# EAGLE design GPR (EAGLE 9.6.2)
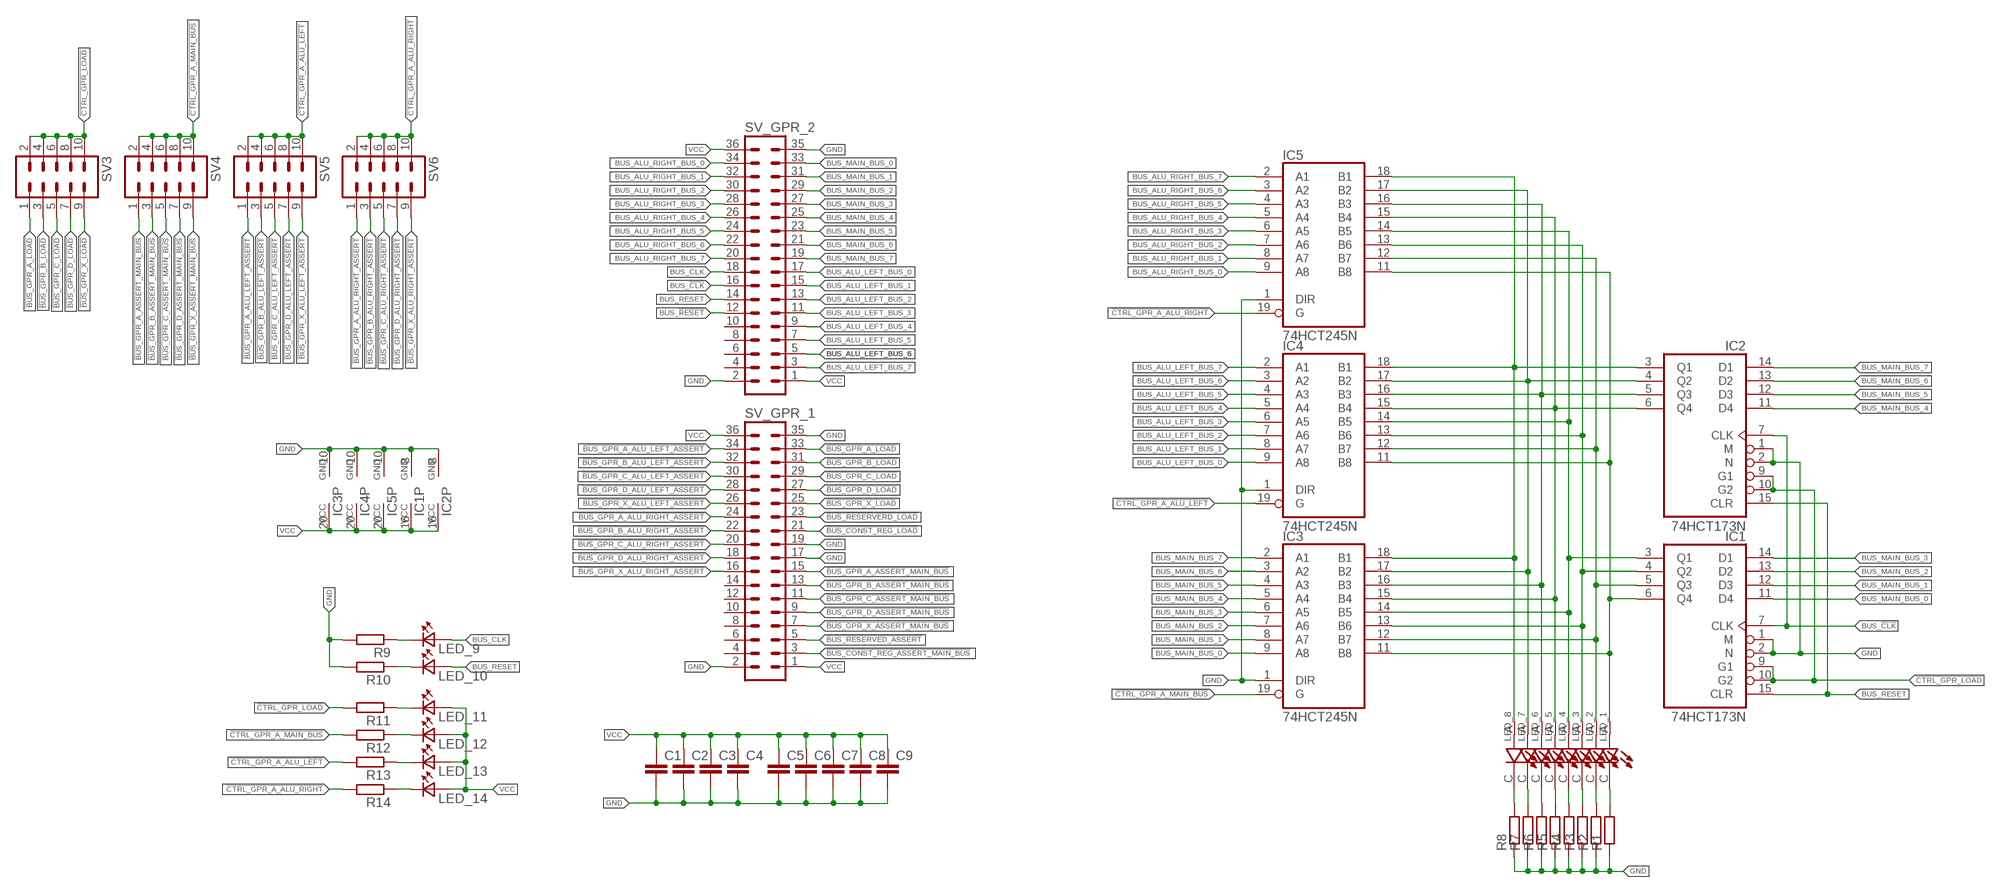
[diagram p0: schematic, sheet 1]

## Parts
C1  C-EUC0805  [C0805]
C2  C-EUC0805  [C0805]
C3  C-EUC0805  [C0805]
C4  C-EUC0805  [C0805]
C5  C-EUC0805  [C0805]
C6  C-EUC0805  [C0805]
C7  C-EUC0805  [C0805]
C8  C-EUC0805  [C0805]
C9  C-EUC0805  [C0805]
IC1  74HCT173N  [DIL16]
IC2  74HCT173N  [DIL16]
IC3  74HCT245N  [DIL20]
IC4  74HCT245N  [DIL20]
IC5  74HCT245N  [DIL20]
LED_1  LTST-C193KRKT-5A  [LEDC1608X45N]
LED_2  LTST-C193KRKT-5A  [LEDC1608X45N]
LED_3  LTST-C193KRKT-5A  [LEDC1608X45N]
LED_4  LTST-C193KRKT-5A  [LEDC1608X45N]
LED_5  LTST-C193KRKT-5A  [LEDC1608X45N]
LED_6  LTST-C193KRKT-5A  [LEDC1608X45N]
LED_7  LTST-C193KRKT-5A  [LEDC1608X45N]
LED_8  LTST-C193KRKT-5A  [LEDC1608X45N]
LED_9  LTST-C193TBKT-5A  [0603]
LED_10  LTST-C193TBKT-5A  [0603]
LED_11  LTST-C193TBKT-5A  [0603]
LED_12  LTST-C193TBKT-5A  [0603]
LED_13  LTST-C193TBKT-5A  [0603]
LED_14  LTST-C193TBKT-5A  [0603]
R1  R-EU_R0805  [R0805]
R2  R-EU_R0805  [R0805]
R3  R-EU_R0805  [R0805]
R4  R-EU_R0805  [R0805]
R5  R-EU_R0805  [R0805]
R6  R-EU_R0805  [R0805]
R7  R-EU_R0805  [R0805]
R8  R-EU_R0805  [R0805]
R9  R-EU_R0805  [R0805]
R10  R-EU_R0805  [R0805]
R11  R-EU_R0805  [R0805]
R12  R-EU_R0805  [R0805]
R13  R-EU_R0805  [R0805]
R14  R-EU_R0805  [R0805]
SV3  MA05-2  [MA05-2]
SV4  MA05-2  [MA05-2]
SV5  MA05-2  [MA05-2]
SV6  MA05-2  [MA05-2]
SV_GPR_1  MA18-2  [MA18-2]
SV_GPR_2  MA18-2  [MA18-2]

## Nets
!BUS_CONST_REG_ASSERT_MAIN_BUS: SV_GPR_1.3
!BUS_CONST_REG_LOAD: SV_GPR_1.21
!BUS_GPR_A_ALU_LEFT_ASSERT: SV5.1 SV_GPR_1.34
!BUS_GPR_A_ALU_RIGHT_ASSERT: SV6.1 SV_GPR_1.24
!BUS_GPR_A_ASSERT_MAIN_BUS: SV4.1 SV_GPR_1.15
!BUS_GPR_A_LOAD: SV3.1 SV_GPR_1.33
!BUS_GPR_B_ALU_LEFT_ASSERT: SV5.3 SV_GPR_1.32
!BUS_GPR_B_ALU_RIGHT_ASSERT: SV6.3 SV_GPR_1.22
!BUS_GPR_B_ASSERT_MAIN_BUS: SV4.3 SV_GPR_1.13
!BUS_GPR_B_LOAD: SV3.3 SV_GPR_1.31
!BUS_GPR_C_ALU_LEFT_ASSERT: SV5.5 SV_GPR_1.30
!BUS_GPR_C_ALU_RIGHT_ASSERT: SV6.5 SV_GPR_1.20
!BUS_GPR_C_ASSERT_MAIN_BUS: SV4.5 SV_GPR_1.11
!BUS_GPR_C_LOAD: SV3.5 SV_GPR_1.29
!BUS_GPR_D_ALU_LEFT_ASSERT: SV5.7 SV_GPR_1.28
!BUS_GPR_D_ALU_RIGHT_ASSERT: SV6.7 SV_GPR_1.18
!BUS_GPR_D_ASSERT_MAIN_BUS: SV4.7 SV_GPR_1.9
!BUS_GPR_D_LOAD: SV3.7 SV_GPR_1.27
!BUS_GPR_X_ALU_LEFT_ASSERT: SV5.9 SV_GPR_1.26
!BUS_GPR_X_ALU_RIGHT_ASSERT: SV6.9 SV_GPR_1.16
!BUS_GPR_X_ASSERT_MAIN_BUS: SV4.9 SV_GPR_1.7
!BUS_GPR_X_LOAD: SV3.9 SV_GPR_1.25
!BUS_RESERVED_ASSERT: SV_GPR_1.5
!BUS_RESERVERD_LOAD: SV_GPR_1.23
!CTRL_GPR_A_ALU_LEFT: IC4.19(G) R13.2 SV5.2 SV5.4 SV5.6 SV5.8 SV5.10
!CTRL_GPR_A_ALU_RIGHT: IC5.19(G) R14.2 SV6.2 SV6.4 SV6.6 SV6.8 SV6.10
!CTRL_GPR_A_MAIN_BUS: IC3.19(G) R12.2 SV4.2 SV4.4 SV4.6 SV4.8 SV4.10
!CTRL_GPR_LOAD: IC1.9(G1) IC1.10(G2) IC2.9(G1) IC2.10(G2) R11.2 SV3.2 SV3.4 SV3.6 SV3.8 SV3.10
BUS_!CLK: IC1.7(CLK) IC2.7(CLK) SV_GPR_2.16
BUS_!RESET: SV_GPR_2.12
BUS_ALU_LEFT_BUS_0: IC4.9(A8) SV_GPR_2.17
BUS_ALU_LEFT_BUS_1: IC4.8(A7) SV_GPR_2.15
BUS_ALU_LEFT_BUS_2: IC4.7(A6) SV_GPR_2.13
BUS_ALU_LEFT_BUS_3: IC4.6(A5) SV_GPR_2.11
BUS_ALU_LEFT_BUS_4: IC4.5(A4) SV_GPR_2.9
BUS_ALU_LEFT_BUS_5: IC4.4(A3) SV_GPR_2.7
BUS_ALU_LEFT_BUS_6: IC4.3(A2) SV_GPR_2.5
BUS_ALU_LEFT_BUS_7: IC4.2(A1) SV_GPR_2.3
BUS_ALU_RIGHT_BUS_0: IC5.9(A8) SV_GPR_2.34
BUS_ALU_RIGHT_BUS_1: IC5.8(A7) SV_GPR_2.32
BUS_ALU_RIGHT_BUS_2: IC5.7(A6) SV_GPR_2.30
BUS_ALU_RIGHT_BUS_3: IC5.6(A5) SV_GPR_2.28
BUS_ALU_RIGHT_BUS_4: IC5.5(A4) SV_GPR_2.26
BUS_ALU_RIGHT_BUS_5: IC5.4(A3) SV_GPR_2.24
BUS_ALU_RIGHT_BUS_6: IC5.3(A2) SV_GPR_2.22
BUS_ALU_RIGHT_BUS_7: IC5.2(A1) SV_GPR_2.20
BUS_CLK: LED_9.2(A2) SV_GPR_2.18
BUS_MAIN_BUS_0: IC1.11(D4) IC3.9(A8) SV_GPR_2.33
BUS_MAIN_BUS_1: IC1.12(D3) IC3.8(A7) SV_GPR_2.31
BUS_MAIN_BUS_2: IC1.13(D2) IC3.7(A6) SV_GPR_2.29
BUS_MAIN_BUS_3: IC1.14(D1) IC3.6(A5) SV_GPR_2.27
BUS_MAIN_BUS_4: IC2.11(D4) IC3.5(A4) SV_GPR_2.25
BUS_MAIN_BUS_5: IC2.12(D3) IC3.4(A3) SV_GPR_2.23
BUS_MAIN_BUS_6: IC2.13(D2) IC3.3(A2) SV_GPR_2.21
BUS_MAIN_BUS_7: IC2.14(D1) IC3.2(A1) SV_GPR_2.19
BUS_RESET: IC1.15(CLR) IC2.15(CLR) LED_10.2(A2) SV_GPR_2.14
GND: C1.2 C2.2 C3.2 C4.2 C5.2 C6.2 C7.2 C8.2 C9.2 IC1.1(M) IC1.2(N) IC1.8(GND) IC2.1(M) IC2.2(N) IC2.8(GND) IC3.1(DIR) IC3.10(GND) IC4.1(DIR) IC4.10(GND) IC5.1(DIR) IC5.10(GND) R1.1 R2.1 R3.1 R4.1 R5.1 R6.1 R7.1 R8.1 R9.2 R10.2 SV_GPR_1.2 SV_GPR_1.17 SV_GPR_1.19 SV_GPR_1.35 SV_GPR_2.2 SV_GPR_2.35
N$1: LED_9.1(K2) R9.1
N$2: LED_10.1(K2) R10.1
N$3: LED_11.1(K2) R11.1
N$4: LED_12.1(K2) R12.1
N$5: LED_13.1(K2) R13.1
N$6: LED_1.C R1.2
N$7: LED_2.C R2.2
N$8: LED_3.C R3.2
N$9: LED_4.C R4.2
N$10: LED_5.C R5.2
N$11: LED_6.C R6.2
N$12: LED_7.C R7.2
N$13: LED_8.C R8.2
N$14: LED_14.1(K2) R14.1
N$36: IC1.3(Q1) IC3.14(B5) IC4.14(B5) IC5.14(B5) LED_4.A
N$39: IC2.4(Q2) IC3.17(B2) IC4.17(B2) IC5.17(B2) LED_7.A
N$68: IC2.6(Q4) IC3.15(B4) IC4.15(B4) IC5.15(B4) LED_5.A
N$70: IC2.5(Q3) IC3.16(B3) IC4.16(B3) IC5.16(B3) LED_6.A
N$72: IC1.6(Q4) IC3.11(B8) IC4.11(B8) IC5.11(B8) LED_1.A
N$73: IC1.5(Q3) IC3.12(B7) IC4.12(B7) IC5.12(B7) LED_2.A
N$74: IC1.4(Q2) IC3.13(B6) IC4.13(B6) IC5.13(B6) LED_3.A
N$77: IC2.3(Q1) IC3.18(B1) IC4.18(B1) IC5.18(B1) LED_8.A
VCC: C1.1 C2.1 C3.1 C4.1 C5.1 C6.1 C7.1 C8.1 C9.1 IC1.16(VCC) IC2.16(VCC) IC3.20(VCC) IC4.20(VCC) IC5.20(VCC) LED_11.2(A2) LED_12.2(A2) LED_13.2(A2) LED_14.2(A2) SV_GPR_1.1 SV_GPR_1.36 SV_GPR_2.1 SV_GPR_2.36
Unconnected: SV_GPR_1.4 SV_GPR_1.6 SV_GPR_1.8 SV_GPR_1.10 SV_GPR_1.12 SV_GPR_1.14 SV_GPR_2.4 SV_GPR_2.6 SV_GPR_2.8 SV_GPR_2.10

## Library data of the parts
C1-C9 = rcl:C-EU: CAPACITOR, European symbol; SPICEPREFIX: C
IC1 IC2 = 74xx-eu:74*173: 4-bit D type REGISTER, 3-state
IC3-IC5 = 74xx-eu:74*245: Octal BUS TRANSCEIVER, 3-state
LED_1-LED_8 = Dargon's_lib:LTST-C193KRKT-5A: Red 631nm LED Indication - Discrete 2V 0603 (1608 Metric); MANUFACTURER: Lite-On; MAXIMUM_PACKAGE_HEIGHT: 0.45 mm; PARTREV: C; STANDARD: IPC 7351B
LED_9-LED_14 = Dargon's_lib:LTST-C193TBKT-5A: http://octopart.com/ltst-c190tbkt-lite-on-550003
R1-R14 = rcl:R-EU_: RESISTOR, European symbol; SPICEPREFIX: R
SV3-SV6 = con-lstb:MA05-2: PIN HEADER; OC_FARNELL: unknown; OC_NEWARK: unknown
SV_GPR_1 SV_GPR_2 = con-lstb:MA18-2: PIN HEADER; OC_FARNELL: unknown; OC_NEWARK: unknown

## Board
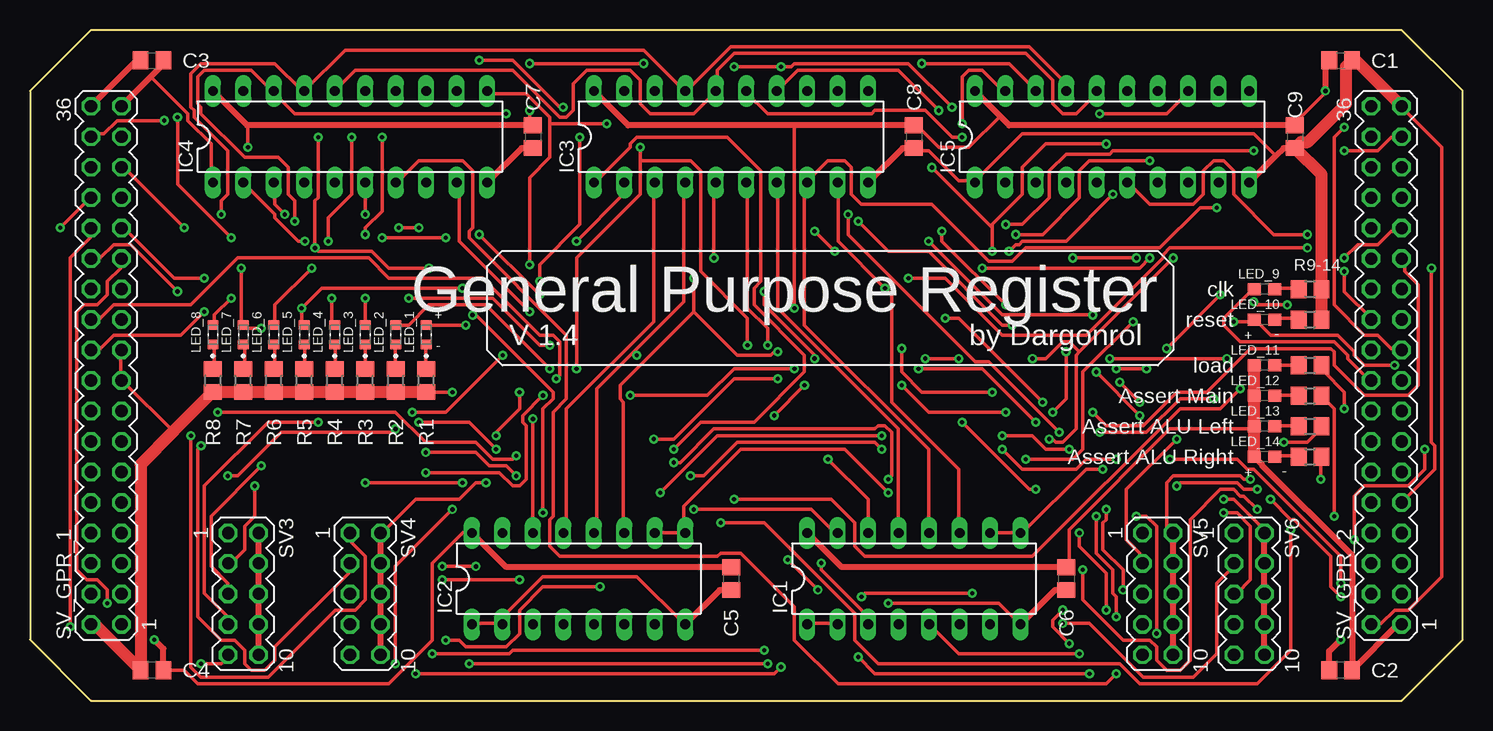
[diagram p1: board, top side]
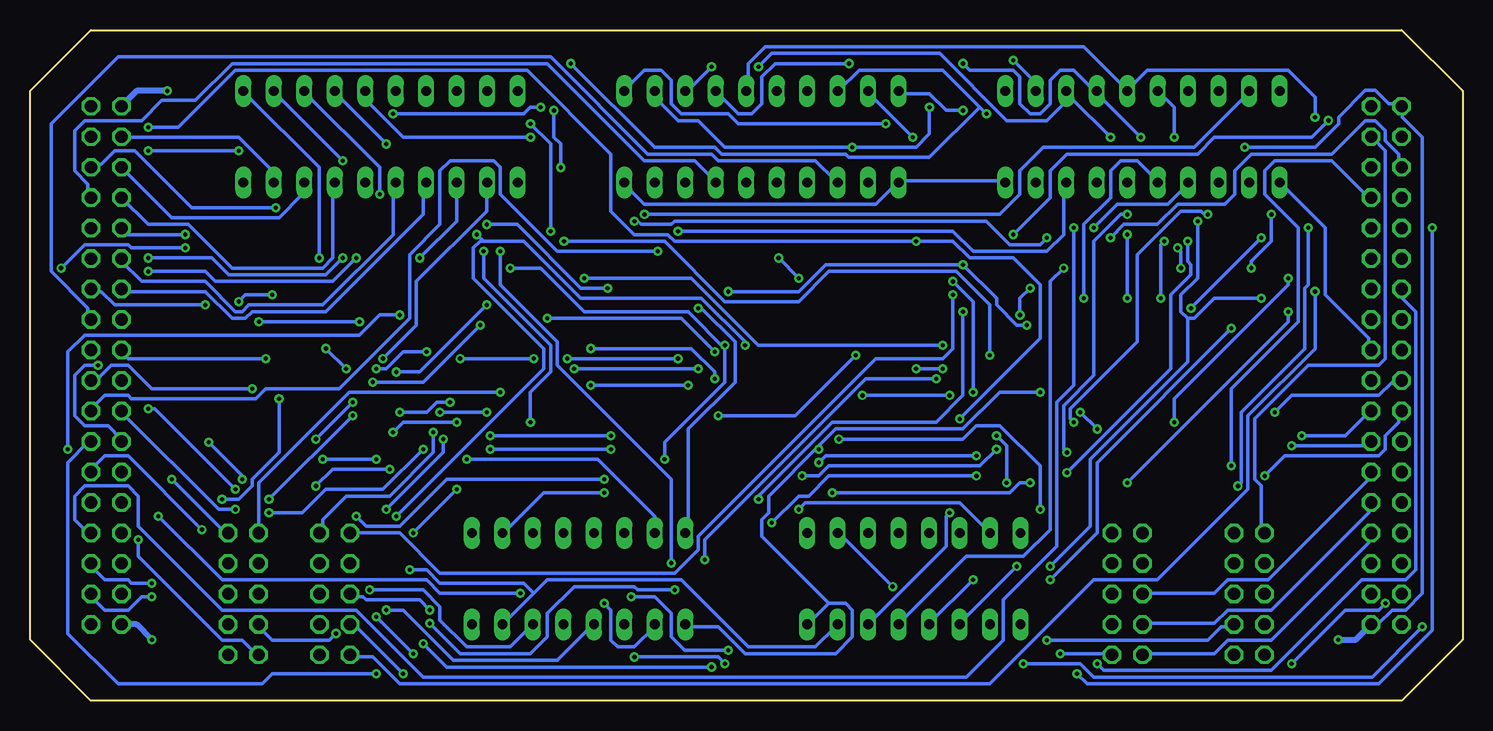
[diagram p2: board, bottom side, seen from below]

Size 119.38 x 55.88 mm. Coordinates in mm from the lower left corner, seen from the top.
Outline: 0,50.8 0,5.08 5.08,0 114.3,0 119.38,5.08 119.38,50.8 114.3,55.88 5.08,55.88 0,50.8
Copper layers (1*16): Top 0.035mm / dielectric 1.5mm / Bottom 0.035mm
Design rules "default *": minimum track width 12mil, minimum drill 0.35mm, track to track 10mil, track to pad 10mil, pad to pad 6mil, via to via 6mil, smd to smd 6mil, copper to edge 40mil, drill to drill 6mil, minimum pad ring 10mil, minimum via ring 8mil, stop-mask expansion 4mil, vias tented up to drill 0mil, thermal gap 10mil

### Footprints (pad centres in the part's own frame; a part is rotated, then mirrored left to right if it is on the bottom)
C0805 = smd 1.3 x 1.5: 1 -0.95,0; 2 0.95,0
DIL16 = drill 0.813 long: 1 -8.89,-3.81; 2 -6.35,-3.81; 3 -3.81,-3.81; 4 -1.27,-3.81; 5 1.27,-3.81; 6 3.81,-3.81; 7 6.35,-3.81; 8 8.89,-3.81; 9 8.89,3.81; 10 6.35,3.81; 11 3.81,3.81; 12 1.27,3.81; 13 -1.27,3.81; 14 -3.81,3.81; 15 -6.35,3.81; 16 -8.89,3.81
DIL20 = drill 0.813 long: 1 -11.43,-3.81; 2 -8.89,-3.81; 3 -6.35,-3.81; 4 -3.81,-3.81; 5 -1.27,-3.81; 6 1.27,-3.81; 7 3.81,-3.81; 8 6.35,-3.81; 9 8.89,-3.81; 10 11.43,-3.81; 11 11.43,3.81; 12 8.89,3.81; 13 6.35,3.81; 14 3.81,3.81; 15 1.27,3.81; 16 -1.27,3.81; 17 -3.81,3.81; 18 -6.35,3.81; 19 -8.89,3.81; 20 -11.43,3.81
LEDC1608X45N = smd 0.81 x 0.93: A 0.81,0; C -0.81,0
0603 = smd 1.1 x 1: 1 -0.85,0; 2 0.85,0
R0805 = smd 1.3 x 1.5: 1 -0.95,0; 2 0.95,0
MA05-2 = drill 1.016 octagon: 1 -5.08,-1.27; 2 -5.08,1.27; 3 -2.54,-1.27; 4 -2.54,1.27; 5 0,-1.27; 6 0,1.27; 7 2.54,-1.27; 8 2.54,1.27; 9 5.08,-1.27; 10 5.08,1.27
MA18-2 = drill 1.016 octagon: 1 -21.59,-1.27; 2 -21.59,1.27; 3 -19.05,-1.27; 4 -19.05,1.27; 5 -16.51,-1.27; 6 -16.51,1.27; 7 -13.97,-1.27; 8 -13.97,1.27; 9 -11.43,-1.27; 10 -11.43,1.27; 11 -8.89,-1.27; 12 -8.89,1.27; 13 -6.35,-1.27; 14 -6.35,1.27; 15 -3.81,-1.27; 16 -3.81,1.27; 17 -1.27,-1.27; 18 -1.27,1.27; 19 1.27,-1.27; 20 1.27,1.27; 21 3.81,-1.27; 22 3.81,1.27; 23 6.35,-1.27; 24 6.35,1.27; 25 8.89,-1.27; 26 8.89,1.27; 27 11.43,-1.27; 28 11.43,1.27; 29 13.97,-1.27; 30 13.97,1.27; 31 16.51,-1.27; 32 16.51,1.27; 33 19.05,-1.27; 34 19.05,1.27; 35 21.59,-1.27; 36 21.59,1.27

### Placement (x,y rotation side)
C1  109.22,53.34 0 top
C2  109.22,2.54 180 top
C3  10.16,53.34 0 top
C4  10.16,2.54 180 top
C5  58.42,10.16 270 top
C6  86.36,10.16 270 top
C7  41.91,46.99 270 top
C8  73.66,46.99 270 top
C9  105.41,46.99 270 top
IC1  73.66,10.16 0 top
IC2  45.72,10.16 0 top
IC3  58.42,46.99 0 top
IC4  26.67,46.99 0 top
IC5  90.17,46.99 0 top
LED_1  33.02,30.48 90 top
LED_2  30.48,30.48 90 top
LED_3  27.94,30.48 90 top
LED_4  25.4,30.48 90 top
LED_5  22.86,30.48 90 top
LED_6  20.32,30.48 90 top
LED_7  17.78,30.48 90 top
LED_8  15.24,30.48 90 top
LED_9  102.87,34.29 180 top
LED_10  102.87,31.75 180 top
LED_11  102.87,27.94 180 top
LED_12  102.87,25.4 180 top
LED_13  102.87,22.86 180 top
LED_14  102.87,20.32 180 top
R1  33.02,26.67 90 top
R2  30.48,26.67 90 top
R3  27.94,26.67 90 top
R4  25.4,26.67 90 top
R5  22.86,26.67 90 top
R6  20.32,26.67 90 top
R7  17.78,26.67 90 top
R8  15.24,26.67 90 top
R9  106.68,34.29 0 top
R10  106.68,31.75 0 top
R11  106.68,27.94 0 top
R12  106.68,25.4 0 top
R13  106.68,22.86 0 top
R14  106.68,20.32 0 top
SV3  17.78,8.89 270 top
SV4  27.94,8.89 270 top
SV5  93.98,8.89 270 top
SV6  101.6,8.89 270 top
SV_GPR_1  6.35,27.94 90 top
SV_GPR_2  113.03,27.94 90 top

### Tracks (layer width: path | path; a pad name or v marks a point on that pad's centre or on a via)
!BUS_GPR_A_ALU_LEFT_ASSERT  (via drill 0.35)
  Top 0.305: v11.18,48.34 7.26,48.34 6.15,47.22 5.31,47.22 SV_GPR_1.34 | v42.47,33.81 v37.44,38.84
  Bottom 0.305: v11.18,48.34 12.57,46.94 20.68,46.94 22.07,45.54 32.97,45.54 34.37,44.15 34.37,41.91 v37.44,38.84 | v42.47,33.81 42.47,29.34 43.31,28.5 48.9,28.5 63.7,13.69 63.7,12.57 65.66,10.62 85.22,10.62 88.57,13.97 SV5.1
!BUS_GPR_A_ALU_RIGHT_ASSERT  (via drill 0.35)
  Top 0.305: v30.45,3.07 30.45,11.18 v35.2,15.93 | v51.97,21.79 53.65,21.79 58.67,26.82 v62.31,26.82 | v72.64,29.34 72.64,27.38 74.32,25.7 v80.19,25.7
  Bottom 0.305: v30.45,3.07 29.9,2.52 15.93,2.52 8.38,10.06 4.75,10.06 3.91,10.9 3.91,32.41 5.03,33.53 5.03,34.09 SV_GPR_1.24 | v35.2,15.93 35.2,19.56 38.56,22.91 40.51,22.91 41.63,21.79 v51.97,21.79 | v62.31,26.82 62.31,27.38 64.26,29.34 v72.64,29.34 | v80.19,25.7 92.76,25.7 100.31,18.16 100.31,13.97 SV6.1
!BUS_GPR_A_ASSERT_MAIN_BUS  (via drill 0.35)
  Top 0.305: v13.41,22.07 13.41,2.79 14.25,1.96 19.84,1.96 25.43,7.54 27.1,7.54 27.94,8.38 27.94,12.01 26.82,13.13 26.82,13.97 SV4.1
  Bottom 0.305: v13.41,22.07 9.78,22.07 7.82,24.03 SV_GPR_1.15
!BUS_GPR_A_LOAD
  Bottom 0.305: SV3.1 16.76,13.97 16.76,17.88 17.32,18.44 17.32,23.47 12.85,27.94 6.99,27.94 6.43,28.5 6.43,45.82 7.54,46.94 SV_GPR_1.33
!BUS_GPR_B_ALU_LEFT_ASSERT  (via drill 0.35)
  Top 0.305: v95.56,21.79 91.36,17.6 91.36,13.41 92.48,12.29 92.48,11.46 SV5.3 | v90.81,26.54 v92.48,24.87 | v81.86,31.29 81.03,31.29 74.88,37.44 71.53,37.44 v69.01,39.95 | v29.34,38.56 v34.65,38.56
  Bottom 0.305: v92.48,24.87 v95.56,21.79 | v90.81,26.54 86.61,26.54 v81.86,31.29 | v69.01,39.95 68.73,39.95 68.45,39.67 65.94,39.67 65.66,39.95 39.67,39.95 37.72,38 35.2,38 v34.65,38.56 | v29.34,38.56 28.22,39.67 25.43,39.67 23.75,41.35 19.84,41.35 19,42.19 19,44.15 17.6,45.54 10.9,45.54 8.1,48.34 7.26,48.34 6.43,47.5 6.43,46.66 5.31,45.54 5.31,44.7 SV_GPR_1.32
!BUS_GPR_B_ALU_RIGHT_ASSERT  (via drill 0.35)
  Top 0.305: v43.87,26.82 44.15,27.1 44.15,29.9 43.59,30.45 42.47,30.45 37.72,35.2 29.9,35.2 28.22,36.88 17.32,36.88 13.41,32.97 6.99,32.97 5.87,31.85 5.31,31.85 SV_GPR_1.22 | v65.66,9.22 v63.14,11.73 | v86.06,6.43 88.29,6.43 92.76,1.96 96.95,1.96 98.91,3.91 98.91,9.78 100.31,11.18 SV6.3
  Bottom 0.305: v43.87,26.82 49.73,26.82 63.14,13.41 v63.14,11.73 | v65.66,9.22 68.73,9.22 69.01,9.5 74.04,9.5 76.28,7.26 76.28,5.31 77.67,3.91 83.54,3.91 v86.06,6.43
!BUS_GPR_B_ASSERT_MAIN_BUS  (via drill 0.35)
  Top 0.305: v14.25,21.23 13.97,20.95 13.97,6.99 15.93,5.03 17.04,5.03 17.88,4.19 17.88,3.07 18.44,2.52 19.56,2.52 20.4,3.35 20.4,4.47 26.54,10.62 26.54,11.18 SV4.3
  Bottom 0.305: v14.25,21.23 8.1,21.23 7.82,21.51 SV_GPR_1.13
!BUS_GPR_B_LOAD  (via drill 0.35)
  Top 0.305: v12.85,39.4 7.82,44.42 SV_GPR_1.31 | v18.72,17.88 18.72,15.37 17.88,14.53 17.88,12.57 16.76,11.46 SV3.3
  Bottom 0.305: v12.85,39.4 12.85,34.65 13.13,34.37 13.13,29.34 18.44,24.03 18.44,18.16 v18.72,17.88
!BUS_GPR_C_ALU_LEFT_ASSERT  (via drill 0.35)
  Top 0.305: v86.06,7.54 85.22,6.71 85.22,6.15 v86.61,4.75 | v62.59,2.79 62.03,2.23 v32.13,2.23 | v2.52,39.4 5.03,41.91 SV_GPR_1.30
  Bottom 0.305: v86.06,7.54 86.89,8.38 91.36,8.38 91.64,8.66 92.48,8.66 SV5.5 | v86.61,4.75 84.66,2.79 v62.59,2.79 | v32.13,2.23 31.29,1.4 6.99,1.4 2.52,5.87 v2.52,39.4
!BUS_GPR_C_ALU_RIGHT_ASSERT  (via drill 0.35)
  Top 0.305: v14.53,32.41 12.57,30.45 6.99,30.45 5.87,29.34 5.31,29.34 SV_GPR_1.20 | v36.04,18.16 v27.94,18.16 | v52.53,17.32 57.28,22.07 v70.97,22.07 | v81.03,22.07 83.54,22.07 84.66,20.95 v86.61,20.95 | v99.47,15.65 100.58,15.65 101.7,14.53 101.7,10.06 100.58,8.94 SV6.5
  Bottom 0.305: v14.53,32.41 14.53,31.57 v27.94,18.16 | v36.04,18.16 36.88,18.16 37.72,17.32 v52.53,17.32 | v81.03,22.07 v70.97,22.07 | v86.61,20.95 89.97,17.6 94.72,17.6 96.67,15.65 v99.47,15.65
!BUS_GPR_C_ASSERT_MAIN_BUS
  Bottom 0.305: SV4.5 26.54,8.94 20.68,8.94 19.56,10.06 16.2,10.06 7.82,18.44 7.82,19 SV_GPR_1.11
!BUS_GPR_C_LOAD  (via drill 0.35)
  Top 0.305: v19.28,19.56 15.09,15.37 15.09,11.18 16.48,9.78 16.48,8.94 SV3.5
  Bottom 0.305: v19.28,19.56 19.28,25.98 13.69,31.57 13.69,39.4 16.48,42.19 16.48,44.15 15.65,44.98 10.9,44.98 7.82,41.91 SV_GPR_1.29
!BUS_GPR_D_ALU_LEFT_ASSERT  (via drill 0.35)
  Top 0.305: v3.35,6.15 3.35,36.88 5.03,38.56 5.03,39.12 SV_GPR_1.28 | v61.47,3.07 v36.6,3.07 | v69.01,3.63 70.41,2.23 v88.29,2.23
  Bottom 0.305: v3.35,6.15 7.54,1.96 30.73,1.96 31.85,3.07 v36.6,3.07 | v61.47,3.07 62.03,3.63 v69.01,3.63 | v88.29,2.23 92.48,6.43 SV5.7
!BUS_GPR_D_ALU_RIGHT_ASSERT  (via drill 0.35)
  Top 0.305: v15.65,24.03 30.45,24.03 32.97,21.51 37.16,21.51 38.56,20.12 40.23,20.12 v40.51,20.4 | v53.65,19.84 54.2,19.84 57,22.63 70.41,22.63 70.69,22.91 71.25,22.91 71.81,22.35 71.81,18.72 v71.53,18.44 | v92.2,15.37 93.04,15.37 93.88,14.53 v93.88,5.59
  Bottom 0.305: v15.65,24.03 14.25,25.43 6.99,25.43 5.87,26.54 5.31,26.54 SV_GPR_1.18 | v40.51,20.4 53.09,20.4 v53.65,19.84 | v71.53,18.44 84.66,18.44 88.57,14.53 91.36,14.53 v92.2,15.37 | v93.88,5.59 94.44,5.03 99.19,5.03 100.31,6.15 SV6.7
!BUS_GPR_D_ASSERT_MAIN_BUS
  Bottom 0.305: SV4.7 26.54,6.43 20.68,6.43 19.56,7.54 15.93,7.54 7.82,15.65 7.82,16.48 SV_GPR_1.9
!BUS_GPR_D_LOAD  (via drill 0.35)
  Top 0.305: v24.03,23.19 19.84,23.19 14.53,17.88 14.53,8.94 16.48,6.99 16.48,6.43 SV3.7 | v14.53,35.2 12.01,35.2 7.82,39.4 SV_GPR_1.27
  Bottom 0.305: v24.03,23.19 24.03,25.15 14.53,34.65 v14.53,35.2
!BUS_GPR_X_ALU_LEFT_ASSERT  (via drill 0.35)
  Top 0.305: v12.29,34.09 8.38,38 6.99,38 5.87,36.88 5.31,36.88 SV_GPR_1.26
  Bottom 0.305: v12.29,34.09 12.29,29.34 17.88,23.75 17.88,17.6 25.43,10.06 30.73,10.06 39.4,1.4 88.57,1.4 90.81,3.63 92.48,3.63 SV5.9
!BUS_GPR_X_ALU_RIGHT_ASSERT  (via drill 0.35)
  Top 0.305: v16.48,18.72 17.32,18.72 20.95,22.35 30.18,22.35 v30.45,22.63 | v31.85,24.03 34.65,24.03 v39.4,28.78 | v74.88,38.28 81.03,32.13 v88.57,32.13 | v116.23,20.95 116.23,19.28 114.83,17.88 111.2,17.88 110.36,17.04 v110.36,13.41
  Bottom 0.305: v16.48,18.72 14.81,20.4 6.99,20.4 6.43,20.95 6.43,22.07 5.31,23.19 5.31,24.03 SV_GPR_1.16 | v31.85,24.03 v30.45,22.63 | v39.4,28.78 39.4,32.97 42.19,35.76 52.81,35.76 55.32,33.25 61.47,33.25 66.5,38.28 v74.88,38.28 | v88.57,32.13 90.25,32.13 91.92,30.45 114.83,30.45 116.23,29.06 v116.23,20.95 | v110.36,13.41 110.36,12.01 103.38,5.03 101.7,5.03 100.58,3.91 SV6.9
!BUS_GPR_X_ASSERT_MAIN_BUS
  Bottom 0.305: SV4.9 26.54,3.91 20.68,3.91 19.56,5.03 15.93,5.03 7.82,13.13 7.82,13.97 SV_GPR_1.7
!BUS_GPR_X_LOAD  (via drill 0.35)
  Top 0.305: v6.43,8.1 6.43,9.22 5.59,10.06 4.75,10.06 3.91,10.9 3.91,32.41 4.47,32.97 5.59,32.97 6.43,33.81 6.43,34.92 7.54,36.04 7.54,36.6 SV_GPR_1.25 | v14.25,3.07 15.93,3.07 16.48,3.63 SV3.9
  Bottom 0.305: v6.43,8.1 6.99,7.54 9.78,7.54 v14.25,3.07
!CTRL_GPR_A_ALU_LEFT  (via drill 0.35)
  Top 0.305: v104.5,21.51 106.45,21.51 107.57,22.63 R13.2 | v101.7,18.44 101.14,18.44 100.86,18.72 95.28,18.72 94.72,18.16 94.72,14.25 95,13.97 SV5.2 | v68.17,40.51 68.17,38.84 78.79,28.22 79.91,28.22 v85.78,22.35
  Top 0.508: SV5.10 SV5.8 SV5.6 SV5.4 SV5.2
  Bottom 0.305: v104.5,21.51 101.7,18.72 v101.7,18.44 | v68.17,40.51 38.56,40.51 36.88,42.19 36.88,44.15 34.92,46.1 22.35,46.1 17.88,50.57 IC4.19 | v85.78,22.35 85.78,20.68 89.41,17.04 93.04,17.04 95,15.09 95,13.97 SV5.2
!CTRL_GPR_A_ALU_RIGHT  (via drill 0.35)
  Top 0.305: v107.57,18.44 107.57,20.12 R14.2 | v77.67,48.06 77.67,51.97 78.23,52.53 79.35,52.53 81.03,50.85 IC5.19 | v76,39.12 76,38.28 v81.31,32.97 | v92.48,23.75 v88.85,27.38 | v99.47,16.76 100.31,16.76 103.1,13.97 SV6.2
  Top 0.508: SV6.10 SV6.8 SV6.6 SV6.4 SV6.2
  Bottom 0.305: v107.57,18.44 103.1,13.97 SV6.2 | v77.67,48.06 76,46.38 v76,39.12 | v81.31,32.97 86.89,27.38 v88.85,27.38 | v99.47,16.76 v92.48,23.75
!CTRL_GPR_A_MAIN_BUS  (via drill 0.35)
  Top 0.305: v108.69,15.37 108.69,24.31 107.85,25.15 R12.2 | v78.51,8.94 69.57,8.94 v69.29,8.66 | v61.19,4.19 40.23,4.19 39.95,3.91 v33.53,3.91 | v45.82,46.94 45.82,39.67 42.47,36.32 v42.47,34.92 | v40.79,25.7 40.79,24.31 38.84,22.35 v38.84,22.07 | v38,18.16 37.16,18.16 35.76,16.76 32.13,16.76 29.34,13.97 SV4.2
  Top 0.508: SV4.10 SV4.8 SV4.6 SV4.4 SV4.2
  Bottom 0.305: v108.69,15.37 103.38,10.06 86.33,10.06 85.22,8.94 v78.51,8.94 | v69.29,8.66 67.33,8.66 65.94,7.26 65.94,5.31 64.82,4.19 v61.19,4.19 | v33.53,3.91 29.34,3.91 SV4.10 | v45.82,46.94 49.45,50.57 IC3.19 | v42.47,34.92 40.79,33.25 v40.79,25.7 | v38.84,22.07 38,21.23 v38,18.16
!CTRL_GPR_LOAD  (via drill 0.35)
  Top 0.305: 54.48,13.97 IC2.10 | v109.53,24.31 109.53,25.7 107.85,27.38 107.85,27.94 R11.2 | v102.26,17.6 101.14,17.6 100.58,18.16 95.83,18.16 v95.56,17.88 | v89.41,19.28 88.01,19.28 82.7,13.97 IC1.9 IC1.10 | 54.48,13.97 54.48,16.2 59.23,20.95 67.89,20.95 v71.53,17.32 | 54.48,13.97 IC2.9 | v34.65,5.03 35.76,5.03 36.32,4.47 39.67,4.47 40.79,5.59 40.79,7.54 42.75,9.5 v47.5,9.5
  Top 0.508: SV3.10 SV3.8 SV3.6 SV3.4 SV3.2
  Bottom 0.305: v109.53,24.31 108.97,24.31 v102.26,17.6 | v95.56,17.88 94.16,19.28 v89.41,19.28 | v71.53,17.32 76.56,17.32 79.91,13.97 IC1.10 | v34.65,5.03 21.23,5.03 20.12,6.15 19.28,6.15 SV3.8 | v47.5,9.5 51.97,13.97 IC2.10
BUS_!CLK  (via drill 0.35)
  Top 0.305: v102.26,15.93 101.14,17.04 100.86,17.04 100.31,17.6 99.19,17.6 96.67,15.09 96.67,3.35 95.83,2.52 94.72,2.52 93.88,3.35 93.88,4.47 93.32,5.03 91.08,5.03 87.73,8.38 v87.73,10.9
  Bottom 0.305: 77.39,8.94 79.91,6.43 IC1.7 | 77.39,8.94 76.28,10.06 65.1,10.06 59.51,4.47 53.92,4.47 52.25,6.15 IC2.7 | v102.26,15.93 103.66,15.93 111.76,24.03 SV_GPR_2.16 | v87.73,10.9 86.33,10.9 85.22,9.78 78.23,9.78 77.39,8.94
BUS_ALU_LEFT_BUS_0  (via drill 0.35)
  Top 0.305: v41.63,32.41 35.76,38.28 35.76,43.03 IC4.9 | v58.67,16.76 66.78,16.76 68.73,14.81 68.73,12.85 69.57,12.01 83.54,12.01 95.83,24.31 99.19,24.31 v100.86,25.98
  Bottom 0.305: v41.63,32.41 41.63,25.43 43.87,23.19 52.53,23.19 58.67,17.04 v58.67,16.76 | v100.86,25.98 109.25,25.98 111.2,27.94 112.6,27.94 113.72,26.82 114.28,26.82 SV_GPR_2.17
BUS_ALU_LEFT_BUS_1  (via drill 0.35)
  Top 0.305: v67.06,37.44 v65.38,39.12
  Bottom 0.305: v65.38,39.12 42.47,39.12 40.79,37.44 34.65,37.44 33.25,38.84 33.25,43.03 IC4.8 | v67.06,37.44 75.44,37.44 80.19,42.19 80.19,44.42 80.75,44.98 84.38,44.98 85.22,44.15 85.22,39.67 87.73,37.16 87.73,31.85 93.6,25.98 99.75,25.98 100.58,25.15 110.92,25.15 111.2,25.43 113.16,25.43 114.28,24.31 SV_GPR_2.15
BUS_ALU_LEFT_BUS_2  (via drill 0.35)
  Top 0.305: v90.53,2.23 89.69,1.4 67.33,1.4 63.7,5.03 63.7,7.82 59.23,12.29 57.56,12.29 57.28,12.01 44.15,12.01 43.31,12.85 43.31,15.09 43.59,15.37 43.59,24.03 44.7,25.15 44.7,30.45 36.6,38.56 36.6,39.12 36.88,39.4 36.88,44.15 36.04,44.98 32.41,44.98 30.73,43.31 IC4.7
  Bottom 0.305: v90.53,2.23 99.19,2.23 100.03,1.4 112.04,1.4 116.23,5.59 116.23,19.84 114.55,21.51 SV_GPR_2.13
BUS_ALU_LEFT_BUS_3  (via drill 0.35)
  Top 0.305: v27.94,40.51 IC4.6 | v32.97,20.68 37.16,20.68 38.28,19.56 39.67,19.56 v40.51,18.72 | v57.56,14.81 61.19,14.81 68.73,7.26 68.73,5.03 70.69,3.07 90.81,3.07 92.48,1.4 102.26,1.4 105.05,4.19 v105.05,14.25
  Bottom 0.305: v27.94,40.51 28.5,40.51 30.73,38.28 30.73,27.1 33.25,24.59 33.25,20.95 v32.97,20.68 | v40.51,18.72 52.81,18.72 54.48,17.04 55.32,17.04 v57.56,14.81 | v105.05,14.25 111.2,20.4 113.16,20.4 114.28,19.28 SV_GPR_2.11
BUS_ALU_LEFT_BUS_4  (via drill 0.35)
  Top 0.305: v31.57,33.53 38.56,33.53 42.47,29.62 v43.31,29.62 | v73.2,35.2 76.28,35.2 81.03,30.45 88.01,30.45 94.44,36.88 94.44,37.16 95,37.72 v106.45,37.72 | v116.79,36.04 116.79,21.51 117.07,21.23 117.07,19.28 SV_GPR_2.9
  Bottom 0.305: v31.57,33.53 31.57,39.67 29.34,41.91 29.34,44.15 28.5,44.98 27.1,44.98 25.43,43.31 IC4.5 | v43.31,29.62 58.67,29.62 64.26,35.2 v73.2,35.2 | v106.45,37.72 110.92,37.72 111.2,38 114.83,38 v116.79,36.04
BUS_ALU_LEFT_BUS_5  (via drill 0.35)
  Top 0.305: v32.41,39.4 v30.73,39.4
  Bottom 0.305: v30.73,39.4 28.78,41.35 24.59,41.35 22.91,43.03 IC4.4 | v32.41,39.4 32.41,26.26 33.81,24.87 33.81,12.85 38.28,8.38 38.28,5.03 41.35,1.96 86.61,1.96 92.2,7.54 103.38,7.54 110.36,14.53 110.36,17.04 111.2,17.88 114.83,17.88 115.67,17.04 115.67,15.09 114.55,13.97 SV_GPR_2.7
BUS_ALU_LEFT_BUS_6  (via drill 0.35)
  Top 0.305: v21.23,40.51 20.4,41.35 20.4,43.03 IC4.3 | v32.41,23.19 36.6,23.19 v38.84,20.95 | v55.04,18.72 56.16,18.72 58.95,21.51 70.41,21.51 v70.97,20.95 | v81.03,20.95 82.7,19.28 87.17,19.28 88.01,20.12 v90.53,20.12 | v95,20.12 100.58,20.12 101.42,19.28 101.98,19.28 109.25,12.01 v109.25,9.78
  Bottom 0.305: v21.23,40.51 21.51,40.51 21.79,40.79 23.47,40.79 27.1,37.16 27.1,29.9 32.69,24.31 32.69,23.47 v32.41,23.19 | v38.84,20.95 40.23,19.56 52.81,19.56 53.65,18.72 v55.04,18.72 | v81.03,20.95 v70.97,20.95 | v95,20.12 v90.53,20.12 | v109.25,9.78 110.92,9.78 111.2,10.06 113.16,10.06 114.28,11.18 SV_GPR_2.5
BUS_ALU_LEFT_BUS_7  (via drill 0.35)
  Top 0.305: v22.91,38.28 22.35,38.28 20.4,40.23 20.4,40.51 17.88,43.03 IC4.2 | v32.97,19 39.12,19 40.23,17.88 40.79,17.88 41.35,18.44 41.35,22.91 41.07,23.19 41.07,23.75 v42.75,25.43 | v50.01,25.43 56.44,25.43 58.67,27.66 v63.7,27.66 | v74.04,27.66 79.35,27.66 v83.82,23.19 | v89.13,22.35 93.04,22.35 95.83,25.15 v98.63,25.15 | v103.38,16.76 105.05,15.09 105.33,15.09 108.41,12.01 108.41,9.5 v109.25,8.66
  Bottom 0.305: v22.91,38.28 22.91,36.6 22.63,36.32 22.63,35.48 24.31,33.81 24.31,27.66 v32.97,19 | v50.01,25.43 v42.75,25.43 | v74.04,27.66 v63.7,27.66 | v83.82,23.19 88.29,23.19 v89.13,22.35 | v98.63,25.15 98.63,20.68 100.86,18.44 100.86,17.88 101.98,16.76 v103.38,16.76 | v109.25,8.66 110.08,8.66 111.2,7.54 113.16,7.54 114.28,8.66 SV_GPR_2.3
BUS_ALU_RIGHT_BUS_0
  Bottom 0.305: IC5.9 99.19,43.31 99.19,44.15 101.98,46.94 111.76,46.94 SV_GPR_2.34
BUS_ALU_RIGHT_BUS_1
  Bottom 0.305: IC5.8 96.67,43.03 96.67,42.19 98.63,40.23 107.57,40.23 111.76,44.42 SV_GPR_2.32
BUS_ALU_RIGHT_BUS_2
  Bottom 0.305: SV_GPR_2.30 109.53,39.67 106.17,39.67 102.54,36.04 95,36.04 94.16,36.88 94.16,43.03 IC5.7
BUS_ALU_RIGHT_BUS_3  (via drill 0.35)
  Top 0.305: v106.45,38.84 103.66,38.84 100.31,42.19 100.31,44.15 99.47,44.98 98.63,44.98 97.79,44.15 97.79,42.19 96.95,41.35 93.32,41.35 91.64,43.03 IC5.6
  Bottom 0.305: v106.45,38.84 111.48,38.84 111.76,39.12 SV_GPR_2.28
BUS_ALU_RIGHT_BUS_4
  Bottom 0.305: IC5.5 89.13,43.03 89.13,38.84 95,32.97 101.14,32.97 101.7,32.41 102.26,32.41 104.78,34.92 110.08,34.92 111.76,36.6 SV_GPR_2.26
BUS_ALU_RIGHT_BUS_5
  Bottom 0.305: IC5.4 86.61,43.03 86.61,40.51 94.72,32.41 100.86,32.41 101.42,31.85 102.54,31.85 104.78,34.09 111.76,34.09 SV_GPR_2.24
BUS_ALU_RIGHT_BUS_6  (via drill 0.35)
  Top 0.305: v92.2,36.88 v86.89,36.88 | v109.53,35.76 109.53,34.09 111.76,31.85 SV_GPR_2.22
  Bottom 0.305: IC5.3 83.82,39.95 v86.89,36.88 | v92.2,36.88 94.16,34.92 103.94,34.92 104.78,35.76 v109.53,35.76
BUS_ALU_RIGHT_BUS_7  (via drill 0.35)
  Top 0.305: v99.75,28.5 v89.97,28.5
  Bottom 0.305: v89.97,28.5 87.17,31.29 87.17,34.92 81.31,40.79 81.31,43.03 IC5.2 | v99.75,28.5 111.2,28.5 111.76,29.06 SV_GPR_2.20
BUS_CLK
  Top 0.305: LED_9.2 101.98,34.09 101.7,34.09 99.47,31.85 99.47,31.29 100.86,29.9 108.69,29.9 109.8,28.78 109.8,28.5 111.76,26.54 SV_GPR_2.18
BUS_MAIN_BUS_0  (via drill 0.35)
  Top 0.305: IC3.9 67.33,43.03 67.33,38.28 v71.25,34.37 71.81,33.81 71.81,24.87 77.39,19.28 77.39,13.97 IC1.11 | v109.53,45.82 112.32,45.82 113.44,46.94 114.28,46.94 SV_GPR_2.33 | v101.98,45.82 90.25,45.82 89.97,45.54 86.33,45.54 84.94,44.15 84.94,41.91 82.7,39.67 v81.31,39.67
  Bottom 0.305: v101.98,45.82 v109.53,45.82 | v81.31,39.67 78.79,39.67 73.48,34.37 v71.25,34.37
BUS_MAIN_BUS_1  (via drill 0.35)
  Top 0.305: IC1.12 74.88,13.97 74.88,20.95 64.54,31.29 64.54,43.03 IC3.8 64.82,43.31 66.5,44.98 67.89,44.98 68.45,44.42 68.45,42.19 69.29,41.35 75.16,41.35 79.91,36.6 81.86,36.6 82.98,37.72 94.16,37.72 97.51,41.07 v98.91,41.07
  Bottom 0.305: v98.91,41.07 105.89,41.07 110.64,45.82 112.32,45.82 113.44,44.7 114.28,44.7 SV_GPR_2.31
BUS_MAIN_BUS_2
  Top 0.305: IC3.7 62.31,43.03 62.31,32.69 72.36,22.63 72.36,13.97 IC1.13
  Bottom 0.305: SV_GPR_2.29 114.55,41.91 114.55,43.03 115.67,44.15 115.67,47.5 114.83,48.34 110.08,48.34 108.41,50.01 105.61,50.01 102.54,53.09 76.28,53.09 68.17,44.98 63.98,44.98 62.31,43.31 IC3.7
BUS_MAIN_BUS_3  (via drill 0.35)
  Top 0.305: IC1.14 69.85,16.76 v66.5,20.12 | v61.47,29.62 61.47,31.01 59.79,32.69 59.79,43.03 IC3.6 | v109.53,36.88 110.64,38 112.32,38 113.44,39.12 114.28,39.12 SV_GPR_2.27 | v93.32,36.88 92.48,36.04 v79.35,36.04
  Bottom 0.305: v66.5,20.12 66.5,21.51 61.47,26.54 61.47,29.34 | v109.53,36.88 104.22,36.88 102.82,35.48 94.72,35.48 v93.32,36.88 | v79.35,36.04 76.83,36.04 73.2,32.41 64.54,32.41 61.47,29.34 | 61.47,29.34 v61.47,29.62
BUS_MAIN_BUS_4  (via drill 0.35)
  Top 0.305: 55.32,32.41 49.17,26.26 49.17,25.15 49.45,24.87 49.45,13.97 IC2.11 | v55.32,35.2 55.32,32.41 | v57,36.88 57,43.03 IC3.5 | v88.57,24.03 89.69,22.91 92.76,22.91 95.56,25.7 98.07,25.7 101.7,29.34 108.41,29.34 108.69,29.06 108.69,27.94 111.2,25.43 114.83,25.43 115.67,26.26 115.67,34.65 114.55,35.76 114.55,36.6 SV_GPR_2.25 | v84.38,24.87 77.39,31.85 v76.28,31.85 | v62.31,29.06 62.03,29.06 61.75,28.78 58.95,28.78 55.32,32.41
  Bottom 0.305: v57,36.88 v55.32,35.2 | v88.57,24.03 86.33,24.03 85.5,24.87 v84.38,24.87 | v76.28,31.85 65.1,31.85 v62.31,29.06
BUS_MAIN_BUS_5  (via drill 0.35)
  Top 0.305: 50.29,29.06 54.48,33.25 54.48,43.03 IC3.4 | 50.29,29.06 47.22,25.98 47.22,13.97 IC2.12 | v104.78,32.97 102.26,32.97 v101.98,33.25 | v94.72,29.34 v99.19,33.81 | v90.53,27.66 v93.04,27.66 | v86.33,29.06 86.33,25.15 v85.22,24.03 | v81.31,24.03 74.88,24.03 v72.64,26.26 | v62.03,23.75 v64.54,26.26 | 50.29,29.06 v50.57,28.78
  Bottom 0.305: v104.78,32.97 112.32,32.97 113.44,34.09 114.28,34.09 SV_GPR_2.23 | v101.98,33.25 101.42,33.81 v99.19,33.81 | v93.04,27.66 v94.72,29.34 | v90.53,27.66 89.69,27.66 88.29,29.06 v86.33,29.06 | v81.31,24.03 v85.22,24.03 | v64.54,26.26 v72.64,26.26 | v62.03,23.75 55.6,23.75 v50.57,28.78
BUS_MAIN_BUS_6
  Top 0.305: IC2.13 44.7,13.97 44.7,24.31 51.97,31.57 51.97,43.03 IC3.3
  Bottom 0.305: SV_GPR_2.21 114.55,31.85 114.55,32.69 117.63,35.76 117.63,48.06 112.04,53.65 76,53.65 67.89,45.54 62.59,45.54 62.03,44.98 53.92,44.98 52.25,43.31 IC3.3
BUS_MAIN_BUS_7  (via drill 0.35)
  Top 0.305: v41.91,23.47 IC2.14 | v45.54,38.28 49.45,42.19 49.45,43.03 IC3.2 | v109.53,47.78 108.69,46.94 108.69,32.97 111.2,30.45 112.32,30.45 113.44,29.34 114.28,29.34 SV_GPR_2.19
  Bottom 0.305: v41.91,23.47 35.2,30.18 35.2,34.65 37.44,36.88 41.07,36.88 42.47,38.28 v45.54,38.28 65.66,38.28 66.22,38.84 69.01,38.84 70.97,40.79 70.97,45.54 77.95,52.53 102.26,52.53 107.01,47.78 v109.53,47.78
BUS_RESET  (via drill 0.35)
  Top 0.305: v113.72,27.94 111.2,27.94 110.36,28.78 110.36,29.06 108.97,30.45 103.38,30.45 102.26,31.57 LED_10.2 101.98,31.57 v100.31,31.57 | v55.32,15.93 65.1,15.93 67.06,13.97 IC1.15 | v91.92,31.57 87.73,27.38 87.73,20.95 86.89,20.12 v82.98,20.12
  Bottom 0.305: v113.72,27.94 114.83,27.94 115.67,27.1 115.67,23.75 114.83,22.91 112.88,22.91 111.76,21.79 SV_GPR_2.14 | v55.32,15.93 54.76,16.48 41.91,16.48 39.4,13.97 IC2.15 | v91.92,31.57 v100.31,31.57 | v82.98,20.12 72.08,20.12 67.33,15.37 67.33,13.97 IC1.15
GND  (via drill 0.35)
  Top 0.305: C8.2 73.76,45.82 74.88,45.82 77.39,43.31 78.51,43.31 IC5.1 78.79,43.31 82.7,47.22 101.98,47.22 103.81,45.39 | SV_GPR_2.2 111.76,6.43 112.6,6.43 113.72,7.54 114.83,7.54 117.63,10.34 117.63,46.1 114.55,49.17 SV_GPR_2.35 | SV_GPR_1.19 7.54,29.06 7.54,26.82 SV_GPR_1.17 7.82,26.54 11.94,22.42 | 10.06,51.97 13.13,48.9 13.13,48.34 15.09,46.38 15.09,43.31 IC4.1 | IC1.1 64.82,6.43 67.06,6.43 IC1.2 | IC2.1 36.88,6.43 39.12,6.43 IC2.2 39.4,6.43 39.4,6.99 42.75,10.34 50.57,10.34 54.48,6.43 IC2.8 | v71.53,8.1 80.75,8.1 82.42,6.43 IC1.8 | v35.2,25.7 33.25,25.7 R1.1 | v53.65,20.95 55.88,23.19 60.35,23.19 64.54,27.38 64.54,28.78 60.35,32.97 60.35,34.37 60.91,34.92 60.91,44.15 58.12,46.94 50.57,46.94 50.01,46.38 50.01,46.1 47.22,43.31 IC3.1
  Top 0.508: C2.2 108.27,4.13 v109.22,5.08 | C9.2 104.46,46.04 103.81,45.39 IC5.10 | C8.2 72.71,46.04 IC3.10 | C7.2 40.96,46.04 IC4.10 | C3.2 11.11,53.02 10.06,51.97 SV_GPR_1.35 | C5.2 57.47,9.21 IC2.8 | C6.2 85.41,9.21 IC1.8
  Top 1.016: R1.1 R2.1 R3.1 R4.1 R5.1 R6.1 R7.1 R8.1 11.94,22.42 9.21,19.69 C4.2 5.4,6.35 SV_GPR_1.2 | R10.2 R9.2 107.63,43.82 C9.2 105.9,46.53 106.48,46.53 109.68,49.73 109.68,52.85 C1.2 110.49,53.34 SV_GPR_2.35
  Bottom 0.305: IC4.10 38.28,43.31 46.94,43.31 IC3.1 47.22,43.03 48.9,41.35 68.17,41.35 69.85,43.03 IC3.10 | IC4.1 11.46,39.4 11.46,33.81 7.82,30.18 7.82,29.34 SV_GPR_1.19 | 52.81,8.1 51.41,8.1 50.85,7.54 50.85,5.31 52.25,3.91 59.79,3.91 62.03,6.15 64.54,6.15 IC1.1 | 52.81,8.1 54.48,6.43 IC2.8 | v71.53,8.1 70.97,7.54 70.97,5.03 70.41,4.47 69.01,4.47 67.33,6.15 IC1.2 | v35.2,25.7 38.56,25.7 41.63,22.63 52.25,22.63 53.65,21.23 | 53.65,21.23 57.84,17.04 57.84,15.65 58.4,15.09 58.4,13.69 52.81,8.1 | 53.65,21.23 v53.65,20.95
  Bottom 0.508: v109.22,5.08 110.49,6.35 SV_GPR_2.2
N$1
  Top 0.305: LED_9.1 103.94,34.37 105.61,34.37 R9.1
N$2
  Top 0.305: LED_10.1 103.94,31.85 105.61,31.85 R10.1
N$3
  Top 0.305: R11.1 LED_11.1
N$4
  Top 0.305: LED_12.1 103.94,25.43 105.61,25.43 R12.1
N$5
  Top 0.305: LED_13.1 103.94,22.91 105.61,22.91 R13.1
N$6
  Top 0.305: LED_1.C 32.97,29.62 32.97,27.66 R1.2
N$7
  Top 0.305: LED_2.C 30.45,29.62 30.45,27.66 R2.2
N$8
  Top 0.305: R3.2 LED_3.C
N$9
  Top 0.305: LED_4.C 25.43,29.62 25.43,27.66 R4.2
N$10
  Top 0.305: LED_5.C 22.91,29.62 22.91,27.66 R5.2
N$11
  Top 0.305: LED_6.C 20.4,29.62 20.4,27.66 R6.2
N$12
  Top 0.305: LED_7.C 17.88,29.62 17.88,27.66 R7.2
N$13
  Top 0.305: LED_8.C 15.37,29.62 15.37,27.66 R8.2
N$14
  Top 0.305: LED_14.1 103.94,20.4 105.61,20.4 R14.1
N$36  (via drill 0.35)
  Top 0.305: v25.15,33.53 25.15,31.29 LED_4.A | v24.87,38.28 24.87,40.23 26.82,42.19 v26.82,46.94 | IC1.3 69.85,6.99 65.94,10.9 v65.94,11.46 | 80.19,39.4 80.19,39.67 82.7,42.19 82.7,44.42 84.66,46.38 v89.69,46.38 | 80.19,39.4 v80.19,37.44 | v75.72,49.17 72.36,52.53 63.98,52.53 62.31,50.85 IC3.14 | 80.19,39.4 v75.16,44.42 | v51.13,53.09 v41.63,53.09
  Bottom 0.305: v25.15,33.53 25.15,38 v24.87,38.28 | v26.82,46.94 30.45,50.57 IC4.14 30.73,50.85 32.41,52.53 33.53,52.53 34.37,51.69 34.37,49.73 35.2,48.9 36.04,48.9 36.88,49.73 36.88,51.97 37.44,52.53 41.07,52.53 v41.63,53.09 | v65.94,11.46 65.94,18.44 75.44,27.94 75.44,29.9 80.19,34.65 v80.19,37.44 | v89.69,46.38 93.88,50.57 IC5.14 | v75.72,49.17 75.72,46.94 75.16,46.38 v75.16,44.42 | v51.13,53.09 57.28,53.09 58.4,51.97 58.4,49.73 59.23,48.9 60.35,48.9 62.03,50.57 IC3.14
N$39  (via drill 0.35)
  Top 0.305: v17.6,36.04 17.6,31.29 LED_7.A 17.88,31.01 v19.28,31.01 | v15.93,40.51 15.93,41.63 16.48,42.19 16.48,45.82 13.69,48.62 13.69,49.17 13.41,49.45 13.41,52.25 14.25,53.09 20.4,53.09 22.63,50.85 IC4.17 26.26,54.2 51.13,54.2 54.48,50.85 IC3.17 54.76,50.85 58.4,54.48 83.26,54.48 86.33,51.41 86.33,50.85 IC5.17 | v34.37,10.06 v40.79,10.06
  Bottom 0.305: v17.6,36.04 17.6,36.6 15.93,38.28 v15.93,40.51 | v40.79,10.06 44.42,6.43 IC2.4 | v34.37,10.06 30.45,13.97 30.45,19.84 v19.28,31.01
N$68  (via drill 0.35)
  Top 0.305: v16.76,38.56 12.29,43.03 v12.29,48.62 | LED_5.A 22.63,31.29 v22.63,32.69 24.31,34.37 v36.04,34.37 | v42.75,15.65 42.75,24.31 43.59,25.15 43.59,25.7 37.16,32.13 v36.88,32.13 | v77.67,46.94 76.83,46.94 74.6,49.17 70.41,49.17 70.13,48.9 61.47,48.9 59.79,50.57 IC3.15
  Bottom 0.305: v16.76,38.56 v22.63,32.69 | v12.29,48.62 12.29,50.29 14.53,52.53 26.26,52.53 27.94,50.85 | IC2.6 43.03,12.85 43.03,15.37 v42.75,15.65 | v36.88,32.13 36.88,33.53 v36.04,34.37 | 27.94,50.85 31.57,54.48 58.12,54.48 59.51,53.09 59.51,50.85 IC3.15 | 27.94,50.85 IC4.15 | v77.67,46.94 88.29,46.94 91.36,50.01 91.36,50.57 IC5.15
N$70  (via drill 0.35)
  Top 0.305: IC5.16 88.85,50.57 87.17,48.9 86.06,48.9 85.22,49.73 85.22,51.69 82.98,53.92 58.67,53.92 57.28,52.53 57.28,50.85 IC3.16 57,50.57 55.32,48.9 51.69,48.9 50.85,49.73 50.85,51.69 50.01,52.53 46.38,52.53 45.26,51.41 45.26,49.17 44.7,48.62 44.15,48.62 40.23,52.53 27.1,52.53 25.43,50.85 IC4.16 | v23.47,36.04 20.4,32.97 20.4,31.29 LED_6.A | v24.03,46.94 24.03,41.91 23.75,41.63 v23.75,37.72 24.03,37.44 28.5,37.44 29.9,36.04 v33.25,36.04
  Bottom 0.305: v23.47,36.04 23.47,37.44 v23.75,37.72 | v24.03,46.94 24.03,49.45 25.15,50.57 IC4.16 | v33.25,36.04 34.37,34.92 34.37,14.25 36.6,12.01 41.35,12.01 46.94,6.43 IC2.5
N$72  (via drill 0.35)
  Top 0.305: v36.32,31.29 33.25,31.29 LED_1.A | v41.63,36.32 41.63,43.59 43.31,45.26 43.31,48.06 | 43.31,48.06 43.31,48.62 41.35,50.57 38.28,50.57 IC4.11 | 43.31,48.06 v48.06,48.06 | v91.08,9.22 91.08,10.9 89.41,12.57 89.41,14.81 89.69,15.09 v89.69,15.93 | v84.94,21.79 85.22,21.79 85.5,21.51 86.06,21.51 87.17,22.63 87.17,28.78 87.45,29.06 | v95.28,36.88 87.45,29.06 | v61.19,34.09 61.19,32.97 65.38,28.78 v65.38,28.5 | v77.39,28.5 v74.6,28.5 | v83.54,28.5 84.66,28.5 86.06,29.9 86.61,29.9 87.45,29.06
  Bottom 0.305: v36.32,31.29 37.16,31.29 38.84,32.97 38.84,33.53 v41.63,36.32 53.09,36.32 55.32,34.09 v61.19,34.09 | v48.06,48.06 60.35,48.06 61.19,48.9 65.1,48.9 65.94,49.73 65.94,51.69 66.78,52.53 68.17,52.53 69.85,50.85 IC3.11 | IC1.6 79.35,4.47 82.98,4.47 85.22,6.71 85.22,7.82 86.61,9.22 v91.08,9.22 | v89.69,15.93 84.94,20.68 v84.94,21.79 | v95.28,36.88 95.28,44.42 101.42,50.57 IC5.11 | v74.6,28.5 v65.38,28.5 | v83.54,28.5 v77.39,28.5
N$73  (via drill 0.35)
  Top 0.305: v43.31,27.66 38,32.97 33.25,32.97 31.57,31.29 30.73,31.29 LED_2.A | v45.54,27.66 45.54,36.88 50.85,42.19 50.85,44.98 | v50.85,46.1 50.85,44.98 | v87.45,3.91 77.39,3.91 75.16,6.15 IC1.5 | v90.53,6.99 90.53,8.66 90.25,8.94 90.25,10.9 88.85,12.29 v88.85,15.37 | v59.79,29.62 59.79,31.85 55.88,35.76 55.88,44.15 55.04,44.98 50.85,44.98 | v37.44,53.37 40.23,53.37 44.15,49.45 v44.42,49.45 | v93.32,44.98 88.29,44.98 87.45,44.15 87.45,41.91 84.38,38.84 v82.14,38.84
  Bottom 0.305: v45.54,27.66 v43.31,27.66 | IC3.12 67.06,50.57 67.06,50.01 65.38,48.34 63.7,48.34 61.47,46.1 v50.85,46.1 45.54,46.1 44.42,47.22 v44.42,49.45 | v90.53,6.99 v87.45,3.91 | v88.85,15.37 76.56,27.66 76.56,29.34 82.42,35.2 82.42,37.72 81.86,38.28 81.58,38.28 | 81.58,38.28 78.23,38.28 73.48,33.53 63.42,33.53 59.79,29.9 v59.79,29.62 | v37.44,53.37 35.76,51.69 35.76,50.85 IC4.12 | v93.32,44.98 98.91,50.57 IC5.12 | 81.58,38.28 v82.14,38.84
N$74  (via drill 0.35)
  Top 0.305: v27.94,33.53 LED_3.A | v27.94,38.84 27.94,39.4 29.34,40.79 v29.34,46.94 | v58.67,52.81 v62.59,52.81 63.42,52.81 63.7,53.09 73.2,53.09 v76.83,49.45 | v89.69,7.54 89.69,10.62 87.45,12.85 v87.45,13.97 | v83.82,17.6 83.26,17.6 v77.67,23.19 | v81.58,37.44 82.14,38 82.42,38 82.7,38.28 86.33,38.28 v90.25,42.19 | v89.13,48.9 94.72,48.9 96.39,50.57 IC5.13
  Bottom 0.305: v27.94,38.84 v27.94,33.53 | 32.69,50.29 32.97,50.57 IC4.13 32.69,50.29 | 32.69,50.29 v29.34,46.94 | v62.59,52.81 64.54,50.85 IC3.13 | v58.67,52.81 57.56,53.92 43.59,53.92 38,48.34 34.65,48.34 32.69,50.29 | v89.69,7.54 88.29,7.54 84.1,3.35 75.44,3.35 72.64,6.15 IC1.4 | v83.82,17.6 v87.45,13.97 | v77.67,23.19 77.67,25.7 76,27.38 76,29.62 81.58,35.2 v81.58,37.44 | v90.25,42.19 90.25,44.42 96.39,50.57 IC5.13 | v76.83,49.45 77.67,49.45 78.23,48.9 v89.13,48.9
N$77  (via drill 0.35)
  Top 0.305: v16.76,33.53 15.37,32.13 15.37,31.29 LED_8.A | v22.07,39.95 22.07,41.63 21.51,42.19 21.51,44.42 20.68,45.26 17.88,45.26 14.25,48.9 14.25,49.45 13.97,49.73 13.97,51.97 14.53,52.53 18.44,52.53 20.12,50.85 IC4.18 20.4,50.57 22.07,48.9 v39.67,48.9 | v34.37,11.18 v37.16,11.18 | v74.32,53.09 81.58,53.09 83.82,50.85 IC5.18
  Bottom 0.305: v16.76,33.53 20.68,33.53 22.35,31.85 22.91,31.85 | 22.91,31.85 23.47,32.41 23.47,33.81 22.07,35.2 v22.07,39.95 | v37.16,11.18 41.91,6.43 IC2.3 | v34.37,11.18 31.01,14.53 31.01,20.12 22.91,28.22 22.91,31.85 | v39.67,48.9 40.23,49.45 | 40.23,49.45 43.31,52.53 50.29,52.53 51.97,50.85 IC3.18 | v74.32,53.09 67.33,46.1 62.31,46.1 61.75,45.54 51.41,45.54 51.13,45.26 44.42,45.26 40.23,49.45
VCC  (via drill 0.35)
  Top 0.305: IC2.16 36.04,13.97 33.53,11.46 33.53,5.03 29.9,1.4 13.97,1.4 12.85,2.52 11.18,2.52 C4.1 | C6.1 86.61,11.18 86.61,14.25 95,22.63 101.7,22.63 LED_13.2 | v107.95,50.8 107.85,50.57 105.33,48.06 C9.1 | 80.83,48.7 78.23,46.1 75.72,46.1 73.76,48.06 C8.1 | 63.7,47.94 v63.7,32.69 | v41.63,49.17 41.63,48.06 C7.1 | v18.16,46.1 18.16,47.78 18.1,47.94
  Top 0.508: LED_14.2 102.66,19.68 102.66,19.61 110.17,12.1 C2.1 113.98,6.35 SV_GPR_2.1 | C1.1 107.95,53.02 v107.95,50.8 | C9.1 81.6,47.94 80.83,48.7 IC5.20 | C8.1 63.7,47.94 49.85,47.94 IC3.20 | C7.1 18.1,47.94 IC4.20 | C3.1 8.89,53.34 SV_GPR_1.36 | C4.1 11.11,4.32 v10.35,5.08 | C5.1 39.69,11.11 IC2.16 | C6.1 67.63,11.11 IC1.16
  Top 1.016: LED_14.2 LED_13.2 LED_12.2 LED_11.2
  Bottom 0.305: SV_GPR_1.1 7.54,6.43 6.99,6.43 5.87,7.54 4.75,7.54 3.35,8.94 3.35,46.94 5.03,48.62 5.03,49.45 SV_GPR_1.36 5.31,49.73 6.15,49.73 7.26,50.85 8.1,50.85 10.34,48.62 10.34,48.06 12.29,46.1 v18.16,46.1 | v63.7,32.69 63.42,32.69 60.63,29.9 60.63,26.54 64.54,22.63 64.54,13.97 IC1.16 | v41.63,49.17 43.03,49.17 44.42,50.57 46.94,50.57 IC3.20
  Bottom 0.508: v107.95,50.8 110.49,50.8 SV_GPR_2.36 | v10.35,5.08 8.89,5.08 SV_GPR_1.1

### Text on the board
tPlace: R9-14 | General Purpose Register | clk | + | reset | - | - | V 1.4 | by Dargonrol | + | load | Assert Main | Assert ALU Left | Assert ALU Right | - | +
tNames: LED_9 | LED_10 | LED_11 | LED_12 | LED_13 | LED_14